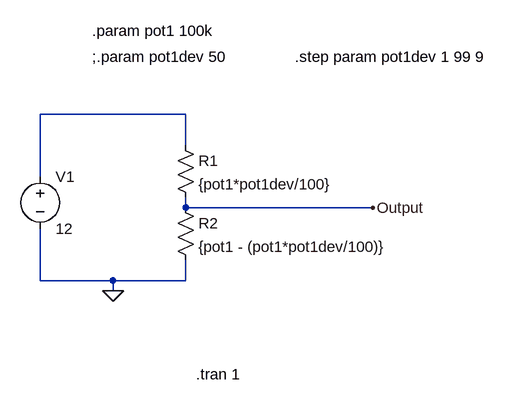
[diagram p0: schematic Potentiometer.asc]
Potentiometer.asc, the LTspice schematic file:
Version 4
SHEET 1 880 680
WIRE 144 0 -80 0
WIRE 144 48 144 0
WIRE -80 96 -80 0
WIRE 144 144 144 128
WIRE 432 144 144 144
WIRE -80 256 -80 176
WIRE 32 256 -80 256
WIRE 144 256 144 224
WIRE 144 256 32 256
WIRE 32 272 32 256
FLAG 432 144 Output
FLAG 32 272 0
SYMBOL res 128 32 R0
SYMATTR InstName R1
SYMATTR Value {pot1*pot1dev/100}
SYMBOL res 128 128 R0
SYMATTR InstName R2
SYMATTR Value {pot1 - (pot1*pot1dev/100)}
SYMBOL voltage -80 80 R0
WINDOW 123 0 0 Left 0
WINDOW 39 0 0 Left 0
SYMATTR InstName V1
SYMATTR Value 12
TEXT 160 400 Left 2 !.tran 1
TEXT 0 -128 Left 2 !.param pot1 100k
TEXT 0 -88 Left 2 !;.param pot1dev 50
TEXT 312 -88 Left 2 !.step param pot1dev 1 99 9

The netlist it stands for:
* Potentiometer.asc
R1 N001 Output {pot1*pot1dev/100}
R2 Output 0 {pot1 - (pot1*pot1dev/100)}
V1 N001 0 12
.tran 1
.param pot1 100k
;.param pot1dev 50
.step param pot1dev 1 99 9
.backanno
.end